# Altium schematic sheet final_sheet.SchDoc
size A; SheetNumber: 1; SheetTotal: 1
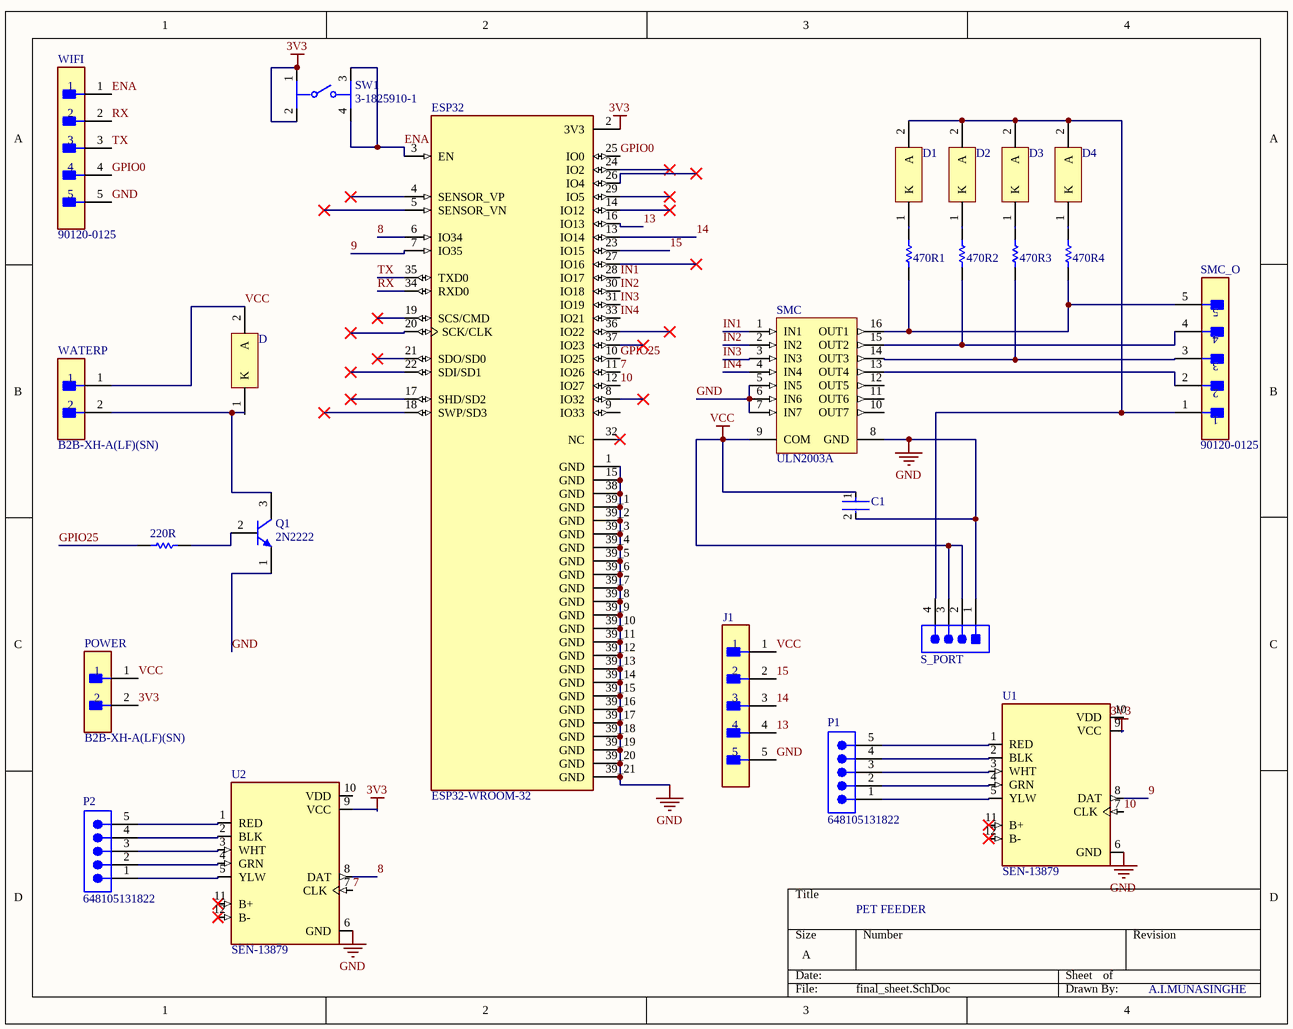
[diagram p0: final_sheet.SchDoc]

## Parts
220R  RC0603FR-07220RL  [RESC1608X55X25ML10T15]  (value not drawn)
470R1  RC0805FR-07470RL  [RESC2013X60X35LL10T20]  (value not drawn)
470R2  RC0805FR-07470RL  [RESC2013X60X35LL10T20]  (value not drawn)
470R3  RC0805FR-07470RL  [RESC2013X60X35LL10T20]  (value not drawn)
470R4  RC0805FR-07470RL  [RESC2013X60X35LL10T20]  (value not drawn)
C1  EMK316BJ106MLHT  [FP-1206-L_3_2_0_15-W_1_6-IPC_B]  (value not drawn)
D  1N4004  [ONSC-AXIAL_LEAD-2-59-10_P]  (value not drawn)
D1  1N4004  [ONSC-AXIAL_LEAD-2-59-10_P]  (value not drawn)
D2  1N4004  [ONSC-AXIAL_LEAD-2-59-10_P]  (value not drawn)
D3  1N4004  [ONSC-AXIAL_LEAD-2-59-10_P]  (value not drawn)
D4  1N4004  [ONSC-AXIAL_LEAD-2-59-10_P]  (value not drawn)
ESP32  ESP32-WROOM-32  [MODULE_ESP32-WROOM-32]
J1  B05B-XASK-1(LF)(SN)  [FP-B05B-XASK-1_LF_SN-MFG]  (value not drawn)
P1  648105131822  [648105131822]
P2  648105131822  [648105131822]
POWER  B2B-XH-A(LF)(SN)  [FP-B2B-XH-A_LF_SN-MFG]
Q1  2N2222  [MLTC-TO-18-3]
S_PORT  640456-4  [TECO-640456-4]  (value not drawn)
SMC  ULN2003A  [STM-DIP-16L]
SMC_O  90120-0125  [FP-90120-0125-MFG]
SW1  3-1825910-1  [FP-3-1825910-1-MFG]
U1  SEN-13879  [SPARKFUN_SEN-13879]
U2  SEN-13879  [SPARKFUN_SEN-13879]
WATERP  B2B-XH-A(LF)(SN)  [FP-B2B-XH-A_LF_SN-MFG]
WIFI  90120-0125  [FP-90120-0125-MFG]

## Nets
3V3: ESP32.2(3V3) POWER.2 SW1.1 SW1.2 U1.9(VCC) U2.9(VCC)
GND: C1.2 ESP32.1(GND) ESP32.15(GND) ESP32.38(GND) ESP32.39_1(GND) ESP32.39_2(GND) ESP32.39_3(GND) ESP32.39_4(GND) ESP32.39_5(GND) ESP32.39_6(GND) ESP32.39_7(GND) ESP32.39_8(GND) ESP32.39_9(GND) ESP32.39_10(GND) ESP32.39_11(GND) ESP32.39_12(GND) ESP32.39_13(GND) ESP32.39_14(GND) ESP32.39_15(GND) ESP32.39_16(GND) ESP32.39_17(GND) ESP32.39_18(GND) ESP32.39_19(GND) ESP32.39_20(GND) ESP32.39_21(GND) J1.5 Q1.1(E) S_PORT.1 SMC.5(IN5) SMC.6(IN6) SMC.7(IN7) SMC.8(GND) U1.6(GND) U2.6(GND) WIFI.5
VCC: C1.1 D.2(A) J1.1 POWER.1 S_PORT.2 S_PORT.3 SMC.9(COM) WATERP.1
7: ESP32.11(IO26) U2.7(CLK)
8: ESP32.6(IO34) U2.8(DAT)
9: ESP32.7(IO35) U1.8(DAT)
10: ESP32.12(IO27) U1.7(CLK)
13: ESP32.16(IO13) J1.4
14: ESP32.13(IO14) J1.3
15: ESP32.23(IO15) J1.2
ENA: ESP32.3(EN) SW1.3 SW1.4 WIFI.1
GPIO0: ESP32.25(IO0) WIFI.4
GPIO25: 220R.1 ESP32.10(IO25)
IN1: ESP32.28(IO17) SMC.1(IN1)
IN2: ESP32.30(IO18) SMC.2(IN2)
IN3: ESP32.31(IO19) SMC.3(IN3)
IN4: ESP32.33(IO21) SMC.4(IN4)
RX: ESP32.34(RXD0) WIFI.2
TX: ESP32.35(TXD0) WIFI.3
Net220R_2: 220R.2 Q1.2(B)
Net470R1_1: 470R1.1 470R4.1 SMC.16(OUT1) SMC_O.5
Net470R1_2: 470R1.2 D1.1(K)
Net470R2_1: 470R2.1 SMC.15(OUT2) SMC_O.4
Net470R2_2: 470R2.2 D2.1(K)
Net470R3_1: 470R3.1 SMC.14(OUT3) SMC_O.3
Net470R3_2: 470R3.2 D3.1(K)
Net470R4_2: 470R4.2 D4.1(K)
NetD1_2: D1.2(A) D2.2(A) D3.2(A) D4.2(A) S_PORT.4 SMC_O.1
NetP1_1: P1.1 U1.5(YLW)
NetP1_2: P1.2 U1.4(GRN)
NetP1_3: P1.3 U1.3(WHT)
NetP1_4: P1.4 U1.2(BLK)
NetP1_5: P1.5 U1.1(RED)
NetP2_1: P2.1 U2.5(YLW)
NetP2_2: P2.2 U2.4(GRN)
NetP2_3: P2.3 U2.3(WHT)
NetP2_4: P2.4 U2.2(BLK)
NetP2_5: P2.5 U2.1(RED)
NetQ1_3: Q1.3(C) WATERP.2
NetSMC_13: SMC.13(OUT4) SMC_O.2

Not connected (* = marked no-connect by the designer): D 1(K); ESP32 4(SENSOR_VP)* 5(SENSOR_VN)* 8(IO32)* 9(IO33) 14(IO12)* 17(SHD/SD2)* 18(SWP/SD3)* 19(SCS/CMD)* 20(SCK/CLK)* 21(SDO/SD0)* 22(SDI/SD1)* 24(IO2)* 26(IO4)* 27(IO16)* 29(IO5)* 32(NC)* 36(IO22)* 37(IO23)*; SMC 10(OUT7) 11(OUT6) 12(OUT5); U1 10(VDD) 11(B+)* 12(B-)*; U2 10(VDD) 11(B+)* 12(B-)*

## Notes on the sheet
- PET FEEDER
- A.I.MUNASINGHE

## Library data of the parts
220R = CMP-1659-00018-2: General Purpose Chip Resistors, 220 Ohm, +/- 1%, -55 to 155 degC, 0603 (1608 Metric), RoHS, Tape and Reel; RoHSCompliant: false; DatasheetVersion: Rev. 4, 04/2009; ComponentLink2Description: Datasheet; ComponentLink2URL: https://datasheet.ciiva.com/11808/0900766b80f96399-11808136.pdf; ComponentLink1URL: http://www.yageo.com/; ComponentLink1Description: Manufacturer URL; PackageReference: 0603; PackageDescription: 2-Pin Surface Mount Device, Body 1.6 x 0.8 mm
470R1-470R4 = CMP-2000-06961-1: Chip Resistor, 470 Ohm, +/- 1%, 125 mW, -55 to 155 degC, 0805 (2012 Metric), RoHS, Tape and Reel; Manufacturer: Yageo; Power Rating: 250mW; Resistor Case Style: 0805[2012Metric]; Voltage Rating: 150V; Resistor Element Type: ThickFilm; Temperature Coefficient: ±100ppm/°C; Resistance: 470ohm; SVHC: ToBeAdvised; Datasheet Version: Rev. 7, 05/2017; Automotive Qualification Standard: -; Mounting Technology: SurfaceMount; Product Range: -; Packaging: Tape&Reel; Package Description: 2-Pin Surface Mounted Device, Body 2 x 1.25 mm; MSL: MSL1-Unlimited; Package Reference: 0805; Resistance Tolerance: ±1%; Datasheet URL: http://www.yageo.com/documents/recent/PYu-RC_Group_51_RoHS_L_7.pdf; Manufacturer URL: http://www.yageo.com/
C1 = CMP-14477-003677-2: None
D D1-D4 = CMP-0902-00115-1: Standard Recovery Rectifier, 2-Pin Axial_Lead, Pb-Free, Bulk Bag; Manufacturer: On Semiconductor; IFSM Max (A): 30; IO(rec) Max (A): 1; VRRM Max (V): 400; Type: Standard Recovery; Packing: Bulk Bag; PackageVersion: Rev. U, 02/2005; ComponentLink1URL: http://www.onsemi.com/; ComponentLink3URL: http://www.onsemi.cn/pub_link/Collateral/59-10.PDF; DatasheetVersion: Rev. 13; PartNumber: 1N4004; ComponentLink1Description: Manufacturer URL; Mounting Technology: Through Hole; PackageReference: AXIAL_LEAD-2-59-10; ComponentLink3Description: Package Specification; ComponentLink2URL: http://www.onsemi.com/pub_link/Collateral/1N4001-D.PDF; ComponentLink2Description: Datasheet; PackageDescription: 2-Pin, Axial Lead, Diameter 2.35 mm; RoHS: TRUE
ESP32 = ESP32-WROOM-32: Bluetooth, WiFi 802.11b/g/n, Bluetooth v4.2 +EDR, Class 1, 2 and 3 Transceiver Module 2.4GHz ~ 2.5GHz Antenna Not Included, U.FL Surface Mount; MF: Espressif Systems; Price: None; Availability: In Stock; MP: ESP32-WROOM-32; Package: Module Espressif Systems; SnapEDA_Link: https://www.snapeda.com/parts/ESP32-WROOM-32/Espressif+Systems/view-part/?ref=snap; Check_prices: https://www.snapeda.com/parts/ESP32-WROOM-32/Espressif+Systems/view-part/?ref=eda; Value: *; Purchase-URL: https://pricing.snapeda.com/search/part/ESP32-WROOM-32/?ref=eda
J1 = CMP-17439-000118-1: CONN HEADER VERT 5POS 2.5MM; Current Rating: 3A; Number of Positions: 5; Voltage Rating: 250V; Lead Length: 3.4mm; Wire/Cable Gauge: 20AWG; Insulation Resistance: 1GR; Gender: Male; Mated Stacking Heights: 11.3mm; Contact Resistance: 10mR; Flammability Rating: UL94 V-0; Max Operating Temperature: 85°C; Number of Rows: 1; Contact Shape: Circular; Pitch: 2.5mm; Orientation: Straight; Color: Beige; Termination: Solder; Number of Pins: 5; Packaging: Bulk; Length: 15mm; Height: 8.8mm; Number of Contacts: 5; Insulation Material: Nylon; Fastening Type: Ramp; Contact Plating: Tin; Connector Type: Header; Voltage Rating (AC): 250V; Mount: Through Hole; Contact Finish - Mating: TIN; Number of Poles: 5; Material: Nylon; Contact Material: Copper Alloy; Insulation Color: Natural; Lead Free: Lead Free; Contact Type: Male Pin; REACH SVHC: No SVHC; Series: XA; Voltage Rating (DC): 250V; Width: 6.4mm; Min Operating Temperature: -25°C
P1 P2 = CMP-1502-00733-2: NexarPartId: 18818254; Number of Contacts: 5; Voltage Rating: 50V; Current Rating: 1A; Contact Resistance: 20mΩ; Gender: Male; Insulation Resistance: 500MΩ; Connector Type: Male Pin; Pitch: 1.5mm; Color: Beige, White; Number of Positions: 5; Lead Pitch: 1.5mm; Mount: Surface Mount; Contact Gender: Male; Contact Material: Copper; Flammability Rating: UL94 V-0; RoHS: Compliant; Packaging: Tape and Reel; REACH SVHC: Unknown; Housing Material: Nylon; Contact Plating: Tin; Height: 3.7mm; Max Operating Temperature: 85°C; Operating Supply Voltage: 50V; Number of Pins: 5; Termination: Solder; Min Operating Temperature: -25°C; Number of Rows: 1; Width: 10.5mm; Length: 10.5mm
POWER WATERP = CMP-2000-05888-3: CONN HEADER VERT 2POS 2.5MM; Current Rating: 3A; Voltage Rating: 250V; Number of Contacts: 2; Contact Resistance: 20mR; Wire/Cable Gauge: 22AWG; Insulation Resistance: 1GR; Connector Type: Male Pin; Packaging: Bulk; Contact Material: Brass; Lead Free: Lead Free; Orientation: Straight; Contact Plating: Tin; Max Current Rating: 3A; Termination: Solder; Fastening Type: Detent; Depth: 5.75mm; Housing Material: Polyamide; REACH SVHC: No SVHC; Series: XH; Voltage Rating (AC): 250V; Number of Positions: 2; Color: Natural; Contact Type: Male Pin; Max Voltage Rating (DC): 250V; Pitch: 2.5mm; Lead Pitch: 2.5mm; Mount: Through Hole; Max Operating Temperature: 85°C; Length: 7.4mm; Max Voltage Rating (AC): 250V; Min Operating Temperature: -25°C; Number of Rows: 1; Housing Color: White
Q1 = CMP-2000-05237-1: Low Power Bipolar NPN Transistor, 30 V, -65 to 200 degC, 3-Pin TO-18, RoHS, Bulk; Manufacturer: Multicomp; Pin Configuration: a; No. of Pins: 3; No. of Transistors: 1; Collector Emitter Voltage Vces: 400mV; Current Ic Continuous a Max: 800mA; Power Dissipation Pd: 500mW; Collector Emitter Voltage V(br)ceo: 30V; Gain Bandwidth ft Typ: 250MHz; Voltage Vcbo: 60V; DC Current Gain hFE: 100; Full Power Rating Temperature: 25degC; Current Ic @ Vce Sat: 150mA; SVHC: NoSVHC(19-Dec-2012); Package Reference: TO-18-3; Package Description: 3-Pin Transistor Outline Package (TO-18), Dia 5.54 mm, Pitch Pitch 1.485mm; Datasheet URL: http://www.farnell.com/datasheets/1662272.pdf; Transistor Case Style: TO-18; Continuous Collector Current Ic Max: 800mA; Manufacturer URL: http://uk.farnell.com/b/multicomp; DC Collector Current: 800mA; Hfe Min: 100; Transistor Polarity: NPN; Power Dissipation Ptot Max: 500mW; Package / Case: TO-18; Datasheet Version: Rev. 1.1, 05/2012; Gain Bandwidth ft Min: 250MHz; Current Ic hFE: 150mA
S_PORT = CMP-2000-05419-1: Male Header, Pitch 2.54 mm, 1 x 4 Position, Height 10.03 mm, Tail Length 3.56 mm, RoHS, Bulk; Manufacturer: TE Connectivity; Material, Housing: Polyester; Primary Type: InterconnectSystem; Mount Angle: Vertical; Color, Housing: White; Current, Rating: 5 / A; Agency Approvals: CSA,UL; Contact Termination Area Plating: Tin; Temperature, Operating: -55to+105 / degC; Standards: RoHSCompliant,ELVCompliant,UL94V-0; Number of Positions: 4; Brand/Series: MTA-100Series; Angle: Straight; Pin Spacing: 0.1 / "; Material, Contact: CopperAlloy; Connector Type: MTA-100; Special Features: Pinstrip; Mounting Hole Size: 0.04 / "; Contact Centerline Spacing: 0.100 / in.; Voltage, Rating: 250 / V; Manufacturer URL: http://www.te.com/; Length, Pin: 0.14 / "; Length, Overall: 0.4 / "; Color: White; Flammability Rating: UL94V-0; Mounting Type: PCMount; Termination: Solder; Datasheet URL: https://datasheet.ciiva.com/16286/eng-ds-82056-mta-0608-16286228.pdf; Number of Contacts: 4; Contact Shape: Square; Contact Mating Area Plating: Tin; Length, Terminal Post: 0.14 / in.; Size, Post: 0.025 / in.; Contact Plating: Tin; Type: PCBPlug; Datasheet Version: Dec-14; Number of Rows: 1
SMC = CMP-2000-07351-1: Seven Darlington Array, 50 V, 0.5 A, -40 to 85 degC, 16-Pin DIP, RoHS, Tube; Manufacturer: STMicroelectronics; Transistor Polarity: NPN; VOUT: 50V; No. of Pins: 16Pins; SVHC: NoSVHC(17-Dec-2015); DC Current Gain hFE: 1000hFE; Output Current: 0.5A; DC Collector Current: 500mA; Transistor Case Style: DIP; Package Reference: DIP-16L; Automotive Qualification Standard: -; Mounting Technology: ThroughHole; Power Dissipation Pd: -; Collector Emitter Voltage V(br)ceo: 50V; Datasheet URL: http://www2.st.com/content/ccc/resource/technical/document/datasheet/f3/6e/c8/64/4d/b3/4e/38/CD00001244.pdf/files/CD00001244.pdf/jcr:content/translations/en.CD00001244.pdf; Manufacturer URL: http://www.st.com/; PartNumber: ULN2003A; MSL: MSL2-1year; Product Range: -; Package Description: 16-Pin DIP, Body 19.7 x 7.1 mm, Pitch 2.54 mm; Operating Temperature Max: 85°C; Datasheet Version: Rev. 8, 06/2012
SMC_O WIFI = CMP-00257-00655425-1: 90120-0125 2.54mm Pitch C-Grid III Header, Single Row, Vertical, 5 Circuits, Tin (Sn) Plating; NexarPartId: 655425; Manufacturer Lifecycle Status: ACTIVE; Lead Length: 2.9mm; Number of Positions: 5; Current Rating: 3A; Mating Post Length: 6.75mm; Glow Wire Compliant: Non-compliant; Contact Resistance: 20mΩ; Voltage Rating: 350V; Gender: Male; Max Voltage Rating (DC): 350.35kV; Max Operating Temperature: 125°C; Number of Pins: 5; Plating: Tin; Contact Material: Brass; Mount: Through Hole; Contact Gender: Male; Packaging: Bulk; Schedule B: 8536694040; Lifecycle Status: Production; Lead Pitch: 2.54mm; Radiation Hardening: No; Orientation: Vertical; Min Operating Temperature: -55°C; Country of Origin: SK; Housing Color: Black; REACH SVHC: No SVHC; Contact Plating: Tin; Number of Rows: 1; Number of Circuits: 5; Termination: Solder; Number of Contacts: 5; Pitch: 2.54mm; Housing Material: Polyester; RoHS: Compliant; Lead Free: Lead Free; Voltage Rating (AC): 350V
SW1 = CMP-03407-000001-1: SWITCH TACTILE SPST-NO 0.05A 24V; Manufacturer: TE Connectivity; Operating Force: 160gf; Contact Current Rating: 50mA; Contact Resistance: 100mΩ; Electromechanical Life: 100000Cycles; Device Class L1: Electromechanical; ComponentLink2URL: https://www.te.com/commerce/DocumentDelivery/DDEController?Action=srchrtrv&DocNm=1825910&DocType=Customer+Drawing&DocLang=English; Category: Switch; Device Class L2: Switches; Temperature: -35°C to +85°C; RoHS: TRUE; Mount: Through Hole; Manufacturer Part Number: 3-1825910-1; Automotive: No; Lead Free: Yes; Device Class L3: Tactile Switches; ComponentLink2Description: Datasheet; Temperature Range High: +85°C; Height: 17.3mm; Package: 0; Temperature Range Low: -35°C; Throw Configuration: SPST-NO; Digikey Description: SWITCH TACTILE SPST-NO 0.05A 24V; Octopart: https://octopart.com/3-1825910-1-te+connectivity-46506874
U1 U2 = SEN-13879: Load Cell Amp Hx711; Package: None; MP: SEN-13879; Price: None; Availability: Unavailable; Value: *